# Altium schematic sheet SoftCore_SA_P7.SchDoc: =ProjectTitle
size B; Engineer: Hab S Collector; Address1: 3621 Gin Way; Address2: Snellville GA, 30039; SheetNumber: 7; SheetTotal: 7
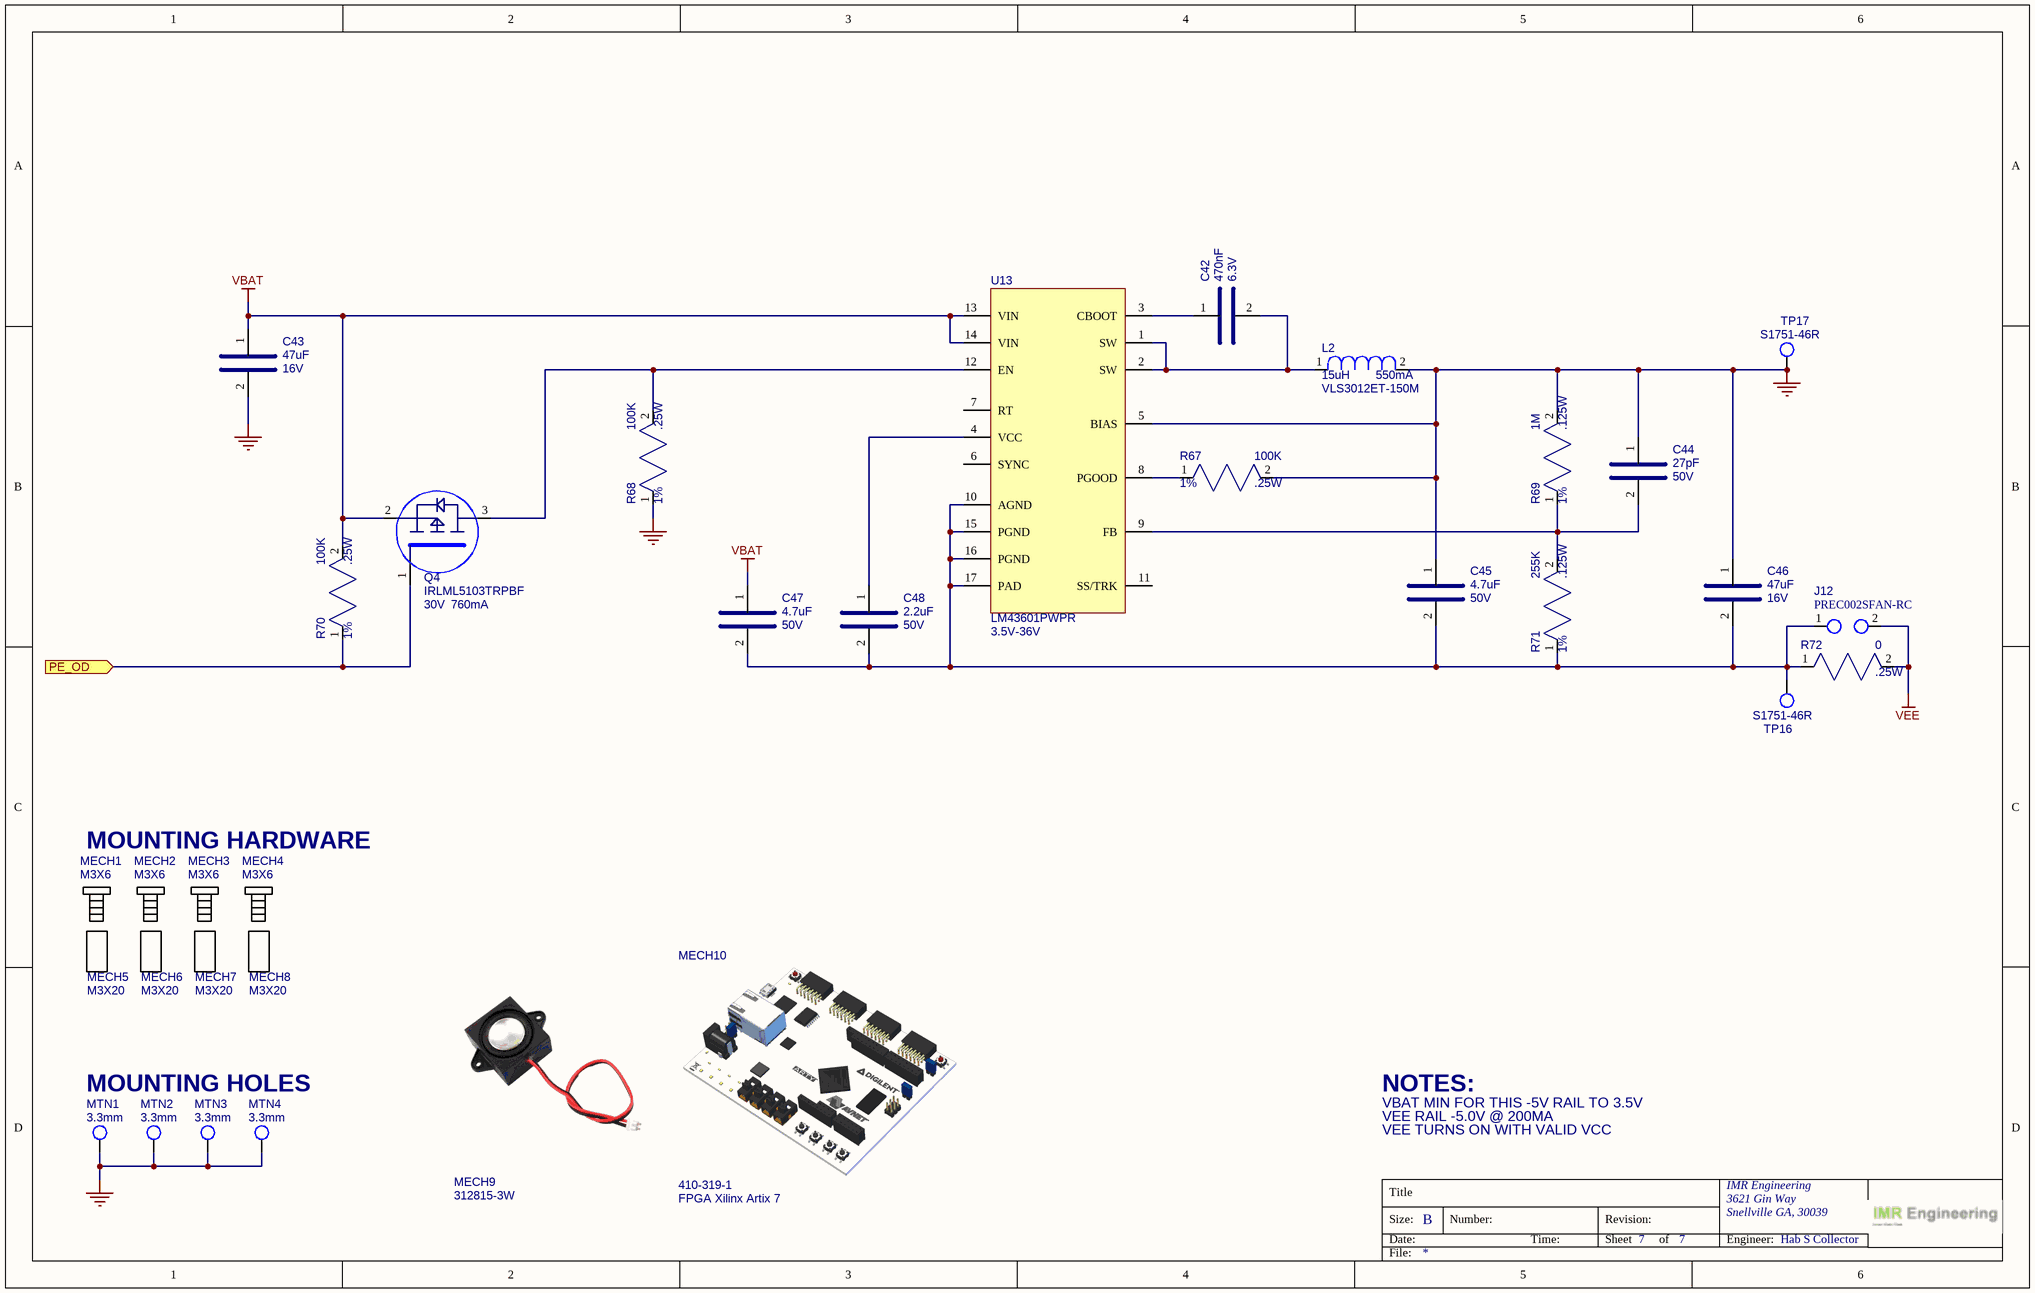
[diagram p0: SoftCore_SA_P7.SchDoc]

## Parts
C42  value 470nF  Voltage: 6.3V  [CAP_0805]  (hidden comment: GRM155R60J474KE19D)
C43  value 47uF  Voltage: 16V  [CAP_1210]  (hidden comment: GRM32ER60J476ME20L)
C44  value 27pF  Voltage: 50V  [CAP_0805]  (hidden comment: C0805C270J5GACTU)
C45  value 4.7uF  Voltage: 50V  [CAP_0805]  (hidden comment: GRM21BR61H475KE51L)
C46  value 47uF  Voltage: 16V  [CAP_1210]  (hidden comment: GRM32ER60J476ME20L)
C47  value 4.7uF  Voltage: 50V  [CAP_0805]  (hidden comment: GRM21BR61H475KE51L)
C48  value 2.2uF  Voltage: 50V  [CAP_0805]  (hidden comment: GRM219R61E225KA12J)
J12  PREC002SFAN-RC  [HDR_1X2_100MILL]
L2  value 15uH  Current: 550mA  [IND_VLS3012ET-150M]  (hidden comment: VLS3012ET-150M)
MECH1  Size: M3X6  [MECHANICAL_SCREW_M3X6]  (hidden comment: RM3X6MM 2701)
MECH2  Size: M3X6  [MECHANICAL_SCREW_M3X6]  (hidden comment: RM3X6MM 2701)
MECH3  Size: M3X6  [MECHANICAL_SCREW_M3X6]  (hidden comment: RM3X6MM 2701)
MECH4  Size: M3X6  [MECHANICAL_SCREW_M3X6]  (hidden comment: RM3X6MM 2701)
MECH5  Size: M3X20  [MECHANICAL_SPACER_F_F_M3X20]  (hidden comment: 24407)
MECH6  Size: M3X20  [MECHANICAL_SPACER_F_F_M3X20]  (hidden comment: 24407)
MECH7  Size: M3X20  [MECHANICAL_SPACER_F_F_M3X20]  (hidden comment: 24407)
MECH8  Size: M3X20  [MECHANICAL_SPACER_F_F_M3X20]  (hidden comment: 24407)
MECH9  312815-3W  [312815-3W_PCB]
MECH10  value FPGA Xilinx Artix 7  [ARTY_A7_DEV_BOARD]  (hidden comment: 410-319-1)
MTN1  Hole Size: 3.3mm  [PMG_MT_HOLE_3.3MM]  (no BOM)
MTN2  Hole Size: 3.3mm  [PMG_MT_HOLE_3.3MM]  (no BOM)
MTN3  Hole Size: 3.3mm  [PMG_MT_HOLE_3.3MM]  (no BOM)
MTN4  Hole Size: 3.3mm  [PMG_MT_HOLE_3.3MM]  (no BOM)
Q4  value 30V  Current: 760mA  [SOT-23]  (hidden comment: IRLML5103TRPBF)
R67  value 100K  Power: .25W  Tolerance: 1%  [RES_0805]  (hidden comment: RC0805FR-07100KL)
R68  value 100K  Power: .25W  Tolerance: 1%  [RES_0805]  (hidden comment: RC0805FR-07100KL)
R69  value 1M  Power: .125W  Tolerance: 1%  [RES_0805]  (hidden comment: RC0805FR-071ML)
R70  value 100K  Power: .25W  Tolerance: 1%  [RES_0805]  (hidden comment: RC0805FR-07100KL)
R71  value 255K  Power: .125W  Tolerance: 1%  [RES_0805]  (hidden comment: RC0805FR-07255KL)
R72  value 0  Power: .25W  [RES_0805]  (hidden comment: RC0805JR-070RL)
TP16  S1751-46R  [HARWIN_S1751]
TP17  S1751-46R  [HARWIN_S1751]
U13  value 3.5V-36V  [SOP65P640X120-17N]  (hidden comment: LM43601PWPR)

## Ports
PE_OD (in)

## Nets
GND: C43.2 C44.1 C45.1 C46.1 L2.2 MTN1.1 MTN2.1 MTN3.1 MTN4.1 R67.2 R68.1 R69.2 TP17.1 U13.5(BIAS)
VBAT: C43.1 C47.1 Q4.2(S) R70.2 U13.13(VIN) U13.14(VIN)
VEE: J12.2 R72.2
PE_OD: Q4.1(G) R70.1 ; port PE_OD
NetC42_1: C42.1 U13.3(CBOOT)
NetC42_2: C42.2 L2.1 U13.1(SW) U13.2(SW)
NetC44_2: C44.2 R69.1 R71.2 U13.9(FB)
NetC45_2: C45.2 C46.2 C47.2 C48.2 J12.1 R71.1 R72.1 TP16.1 U13.10(AGND) U13.15(PGND) U13.16(PGND) U13.17(PAD)
NetC48_1: C48.1 U13.4(VCC)
NetQ4_3: Q4.3(D) R68.2 U13.12(EN)
NetR67_1: R67.1 U13.8(PGOOD)

Not connected (* = marked no-connect by the designer): U13 6(SYNC) 7(RT) 11(SS/TRK)

## Notes on the sheet
- MOUNTING HARDWARE
- MOUNTING HOLES
- VBAT MIN FOR THIS -5V RAIL TO 3.5V
- NOTES:
- VEE RAIL -5.0V @ 200MA
- VEE TURNS ON WITH VALID VCC
- Title
- Size:
- Date:
- B
- Number:
- Time:
- Revision:
- Sheet
- of
- IMR Engineering
- Engineer:
- File:

## Library data of the parts
C42 = CAP_SMD_470NF_50V_0805: CAP CER 0.47UF 6.3V X5R 0402; MFG: Murata Electronics; Case/Package: 0805; MFG_PN: GRM155R60J474KE19D; Supplier 1: DigiKey; Supplier Part Number 1: 490-3266-1-ND; Unit Price: .10
C43 C46 = CAP_SMD_47UF_16V_1210: CAP CER 47UF 50V X5R 1210; MFG: Murata Electronics; Case/Package: 1210; MFG_PN: GRM32ER60J476ME20L; Supplier 1: DigiKey; Supplier Part Number 1: 490-1887-1-ND; Unit Price: .28
C44 = CAP_SMD_27PF_50V_0805: CAP CER 27PF 50V C0G/NP0 0805; MFG: KEMET; Case/Package: 0805; MFG_PN: C0805C270J5GACTU; Supplier 1: DigiKey; Supplier Part Number 1: 399-C0805C270J5GACTUCT-ND; Unit Price: .11
C45 C47 = CAP_SMD_4.7UF_50V_0805: CAP CER 4.7UF 50V X5R 0805; MFG: Murata Electronics; Case/Package: 0805; MFG_PN: GRM21BR61H475KE51L; Supplier 1: DigiKey; Supplier Part Number 1: 490-10751-1-ND; Unit Price: .19
C48 = CAP_SMD_2.2UF_50V_0805: CAP CER 2.2UF 50V X5R 0805; MFG: Murata Electronics; Case/Package: 0805; MFG_PN: GRM219R61E225KA12J; Supplier 1: DigiKey; Supplier Part Number 1: 490-GRM219R61E225KA12JCT-ND; Unit Price: .38
J12 = CONN_JUMPER_2P_100MIL_VERT: CONN HEADER VERT 2POS 2.54MM; MFG: Sullins Connector Solutions; Case/Package: 2P_2.54MM; MFG_PN: PREC002SFAN-RC; Supplier 1: Digi-Key; Supplier Part Number 1: S1212EC-02-ND; Value: *; Unit Price: .07
L2 = INDUCTOR_VLS3012ET-150M: FIXED IND 15UH 550MA 516MOHM SMD; MFG: TDK Corporation; Tolerance: 20%; Case/Package: SRN4018TA; Supplier 1: DigiKey; Supplier Part Number 1: 445-6660-1-ND; Unit Price: .26; MFG_PN: VLS3012ET-150M
MECH1-MECH4 = MECHANICAL_SCREW_M3X6_PAN_HEAD: SCREW M3X6 PAN HEAD SS; MFG: APM Hexseal; Case/Package: SCREW_M3X6; Supplier 1: DigiKey; Supplier Part Number 1: 335-1156-ND; Unit Price: .58; MFG_PN: RM3X6MM 2701
MECH5-MECH8 = MECHANICAL_STANDOFF_M3X20: HEX STANDOFF M3 BRASS 20MM; MFG: Keystone Electronics; Case/Package: STANDOFF_M3X20; Supplier 1: DigiKey; Supplier Part Number 1: 36-24407-ND; Unit Price: 1.36; MFG_PN: 24407
MECH9 = MECHANICAL_SPEAKER_MOUNTED: SPEAKER PANEL MOUNT; MFG: ARDUINO; Case/Package: 312815-3W_PCB; Supplier 1: ARDUINO; Supplier Part Number 1: 312815-3W; Unit Price: 2.50; MFG_PN: 312815-3W
MECH10 = MODULE_ARTY_A7: DEVELOPMENT BOARD FPGA XILINX A7; MFG: Digilent, Inc.; Case/Package: NA; Supplier 1: DigiKey; Supplier Part Number 1: 1286-1206-ND; Unit Price: 299.00; MFG_PN: 410-319-1
MTN1-MTN4 = MTN_HOLE_3.3MM: MOUNTING HOLE 3.3MM
Q4 = MOSFET_PCH_IRLML5103TRPBF: MOSFET P-CH 30V 760MA SOT23; MFG: Infineon Technologies; Case/Package: 8-PowerTDFN; Supplier 1: DigiKey; Supplier Part Number 1: IRLML5103PBFCT-ND; Unit Price: .45; MFG_PN: IRLML5103TRPBF
R67 R68 R70 = RES_SMD_100K_0805_1/4W_1%: RES SMD 100K OHM 1% 1/4W 0805; MFG: Yageo; Case/Package: 0805; MFG_PN: RC0805FR-07100KL; Supplier 1: DigiKey; Supplier Part Number 1: 311-100KCRCT-ND; Unit Price: .13
R69 = RES_SMD_1M_0805_1/8W_1%: RES SMD 1M OHM 1% 1/8W 0805; MFG: Yageo; Case/Package: 0805; MFG_PN: RC0805FR-071ML; Supplier 1: DigiKey; Supplier Part Number 1: 311-1.00MCRCT-ND; Unit Price: .12
R71 = RES_SMD_255K_0805_1/8W_1%: RES SMD 255K OHM 1% 1/8W 0805; MFG: Yageo; Case/Package: 0805; MFG_PN: RC0805FR-07255KL; Supplier 1: DigiKey; Supplier Part Number 1: 311-255KCRCT-ND; Unit Price: .10
R72 = RES_SMD_0_0805_1/8W_1%: RES SMD 0 OHM 1% 1/8W 0805; MFG: Yageo; Case/Package: 0805; MFG_PN: RC0805JR-070RL; Supplier 1: DigiKey; Supplier Part Number 1: 311-0.0ARCT-ND; Unit Price: .1; Tolerance: 1%
TP16 TP17 = CONN_TEST_POINT_S1751-46R: PCB TEST POINT CONNECT; MFG: Harwin Inc; Case/Package: S1751; Supplier 1: Digi-Key; Supplier Part Number 1: 952-1478-1-ND; Value: *; Unit Price: .28; MFG_PN: S1751-46R
U13 = IC_SMPS_LM43601PWPR: IC REG BUCK ADJ 1A 16HTSSOP; MFG: Texas Instruments; Case/Package: 16HTSSOP; Supplier 1: DigiKey; Supplier Part Number 1: 296-40221-1-ND; Unit Price: 4.41; Current: 1A; MFG_PN: LM43601PWPR